# EAGLE design Power Supply V1p1 (EAGLE 9.6.2)
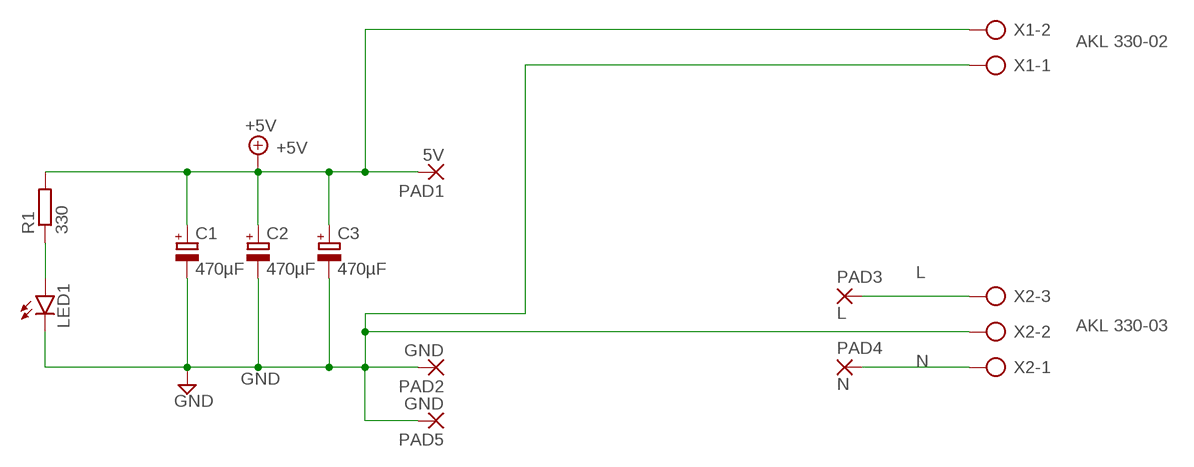
[diagram p0: schematic, sheet 1]

## Parts
C1  470µF  CPOL-EUE5-10.5  [E5-10,5]
C2  470µF  CPOL-EUE5-10.5  [E5-10,5]
C3  470µF  CPOL-EUE5-10.5  [E5-10,5]
LED1  LED5MM  [LED5MM]
PAD1  5V  SMD5  [SMD2,54-5,08]
PAD2  GND  SMD5  [SMD2,54-5,08]
PAD3  L  SMD5  [SMD2,54-5,08]
PAD4  N  SMD5  [SMD2,54-5,08]
PAD5  GND  SMD5  [SMD2,54-5,08]
R1  330  R-EU_R1206  [R1206]
X1  AK500/2-H  [AK500/2-H]
X2  AK500/3-H  [AK500/3-H]

## Nets
+5V: C1.+ C2.+ C3.+ PAD1.1(P) R1.2 X1.2
GND: C1.- C2.- C3.- LED1.K(C) PAD2.1(P) PAD5.1(P) X1.1 X2.2
L: PAD3.1(P) X2.3
N: PAD4.1(P) X2.1
N$1: LED1.A R1.1

## Notes on the sheet
- AKL 330-02
- AKL 330-03

## Library data of the parts
C1-C3 = rcl:CPOL-EU: POLARIZED CAPACITOR, European symbol; SPICEPREFIX: C
LED1 = led:LED: LED OSRAM: - CHIPLED LG R971, LG N971, LY N971, LG Q971, LY Q971, LO R971, LY R971 LH N974, LH R974 LS Q976, LO Q976, LY Q976 LO Q996 - Hyper CHIPLED LW Q18S LB Q993, LB Q99A, LB R99A - SideLED LS A670, LO A670, LY A670, LG A670, LP A670 LB A673, LV A673, LT A673, LW A673 LH A674 LY A675 LS A676, LA A676, LO A676, LY A676, LW A676 LS A679, LY A679, LG A679 - Hyper Micro SIDELED® LS Y876, LA Y876, LO Y876, LY Y876 LT Y87S - SmartLED LW L88C, LW L88S LB L89C, LB L89S, LG L890 LS L89K, LO L89K, LY L89K LS L896, LA L896, LO L896, LY L896 - TOPLED LS T670, LO T670, LY T670, LG T670, LP T670 LSG T670, LSP T670, LSY T670, LOP T670, LYG T670 LG T671, LOG T671, LSG T671 LB T673, LV T673, LT T673, LW T673 LH T674 LS T676, LA T676, LO T676, LY T676, LB T676, LH T676, LSB T676, LW T676 LB T67C, LV T67C, LT T67C, LS T67K, LO T67K, LY T67K, LW E67C LS E67B, LA E67B, LO E67B, LY E67B, LB E67C, LV E67C, LT E67C LW T67C LS T679, LY T679, LG T679 LS T770, LO T770, LY T770, LG T770, LP T770 LB T773, LV T773, LT T773, LW T773 LH T774 LS E675, LA E675, LY E675, LS T675 LS T776, LA T776, LO T776, LY T776, LB T776 LHGB T686 LT T68C, LB T68C - Hyper Mini TOPLED® LB M676 - Mini TOPLED Santana® LG M470 LS M47K, LO M47K, LY M47K Source: http://www.osram.convergy.de LUXEON: - LUMILED® LXK2-PW12-R00, LXK2-PW12-S00, LXK2-PW14-U00, LXK2-PW14-V00 LXK2-PM12-R00, LXK2-PM12-S00, LXK2-PM14-U00 LXK2-PE12-Q00, LXK2-PE12-R00, LXK2-PE12-S00, LXK2-PE14-T00, LXK2-PE14-U00 LXK2-PB12-K00, LXK2-PB12-L00, LXK2-PB12-M00, LXK2-PB14-N00, LXK2-PB14-P00, LXK2-PB14-Q00 LXK2-PR12-L00, LXK2-PR12-M00, LXK2-PR14-Q00, LXK2-PR14-R00 LXK2-PD12-Q00, LXK2-PD12-R00, LXK2-PD12-S00 LXK2-PH12-R00, LXK2-PH12-S00 LXK2-PL12-P00, LXK2-PL12-Q00, LXK2-PL12-R00 Source: www.luxeon.com KINGBRIGHT: KA-3528ASYC Source: www.kingbright.com
PAD1-PAD5 = wirepad:SMD5: SMD PAD
R1 = rcl:R-EU_: RESISTOR, European symbol; SPICEPREFIX: R
X1 = con-ptr500:AK500/2-H: CONNECTOR Aug. 2004 / PTR Meßtechnik: Die Bezeichnung der Serie AK505 wurde geändert. Es handelt sich hierbei um AK500 in horizontaler Ausführung.; OC_FARNELL: unknown; OC_NEWARK: unknown
X2 = con-ptr500:AK500/3-H: CONNECTOR Aug. 2004 / PTR Meßtechnik: Die Bezeichnung der Serie AK505 wurde geändert. Es handelt sich hierbei um AK500 in horizontaler Ausführung.; OC_FARNELL: unknown; OC_NEWARK: unknown

## Board
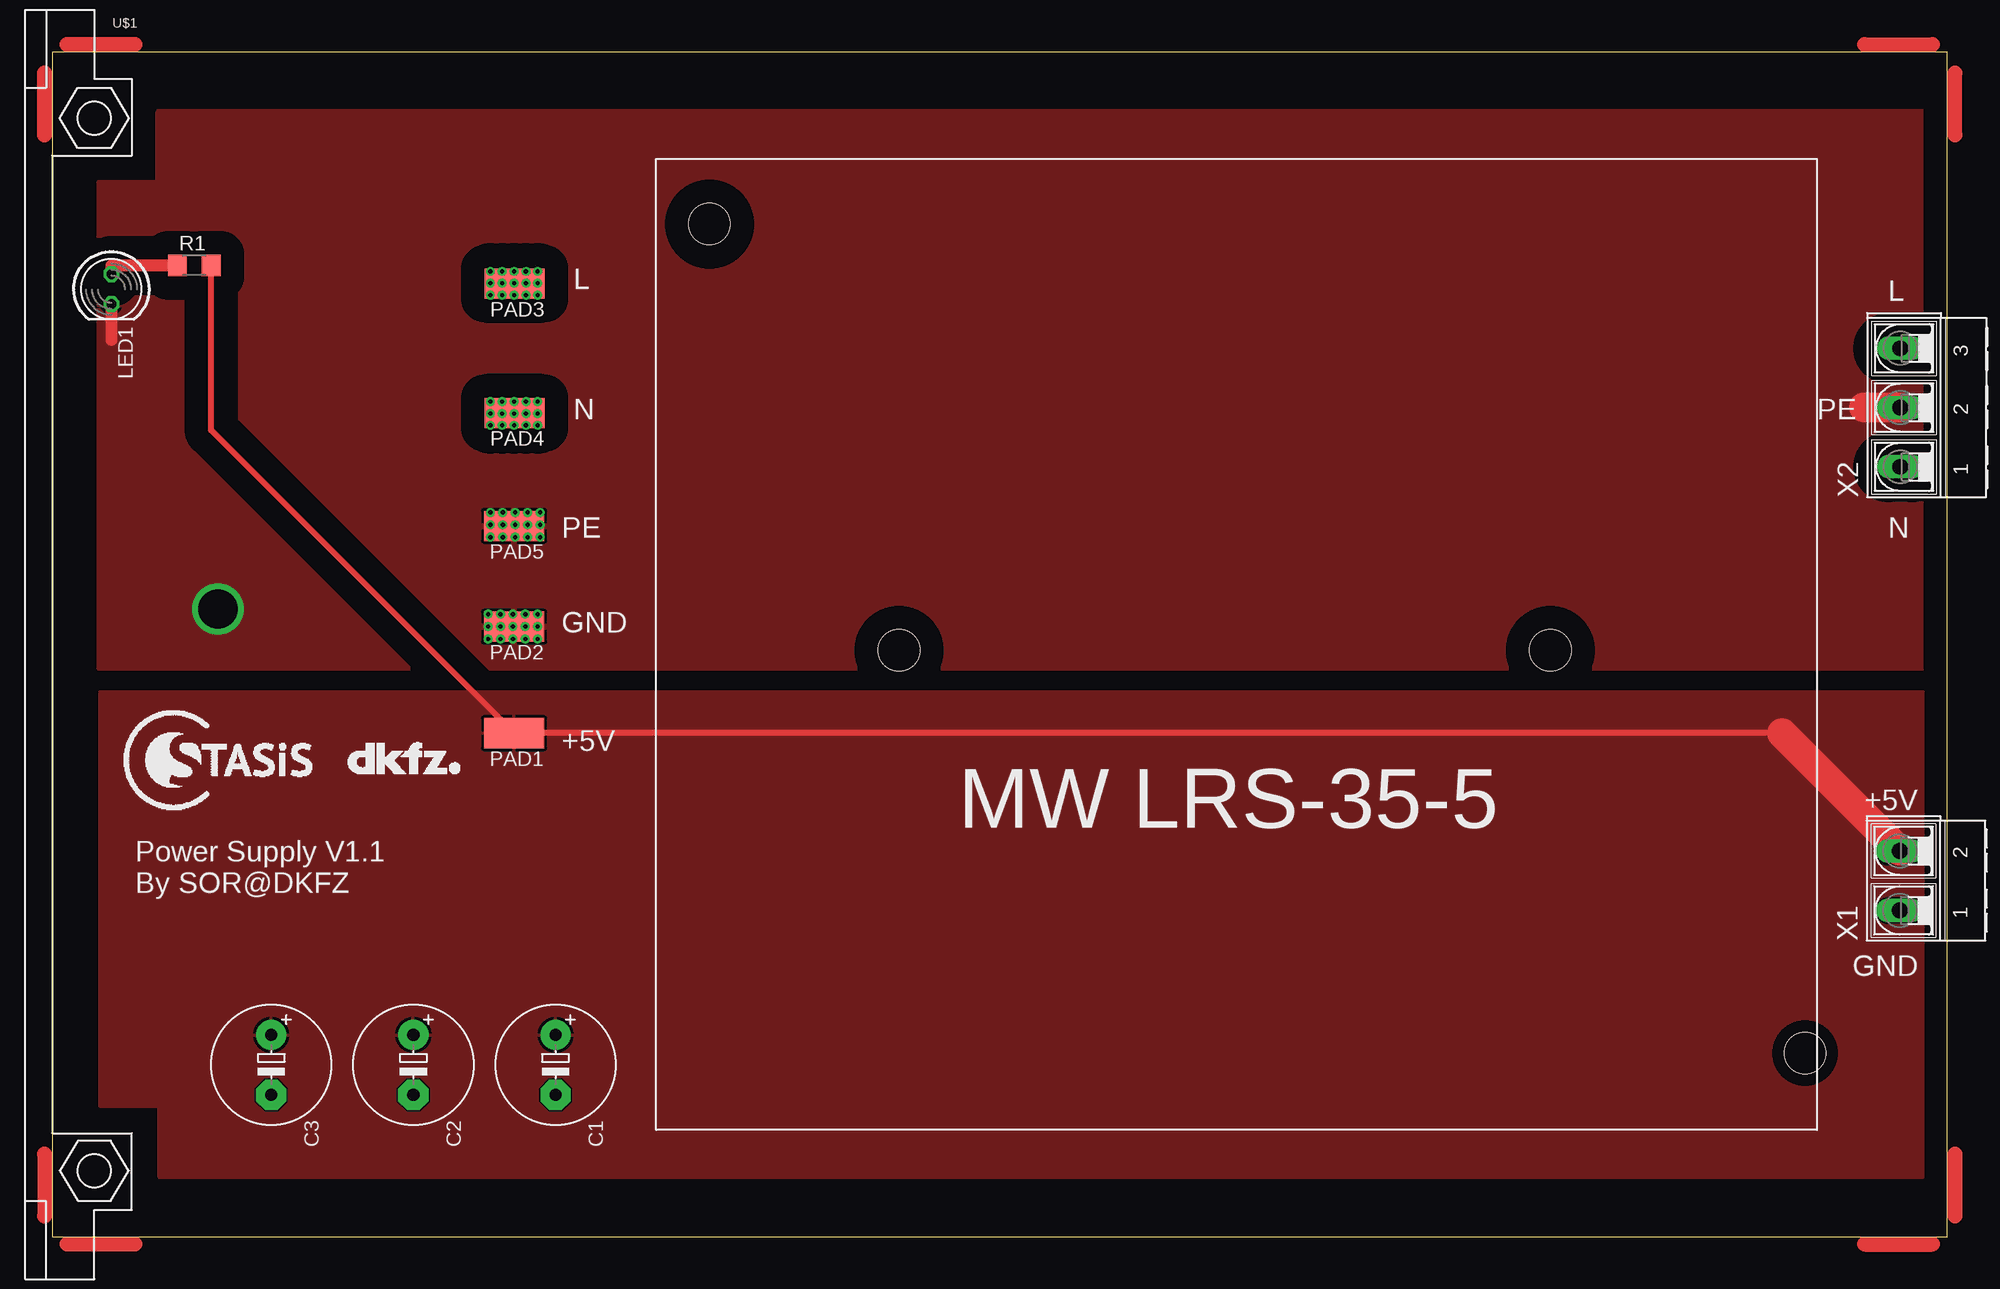
[diagram p1: board, top side]
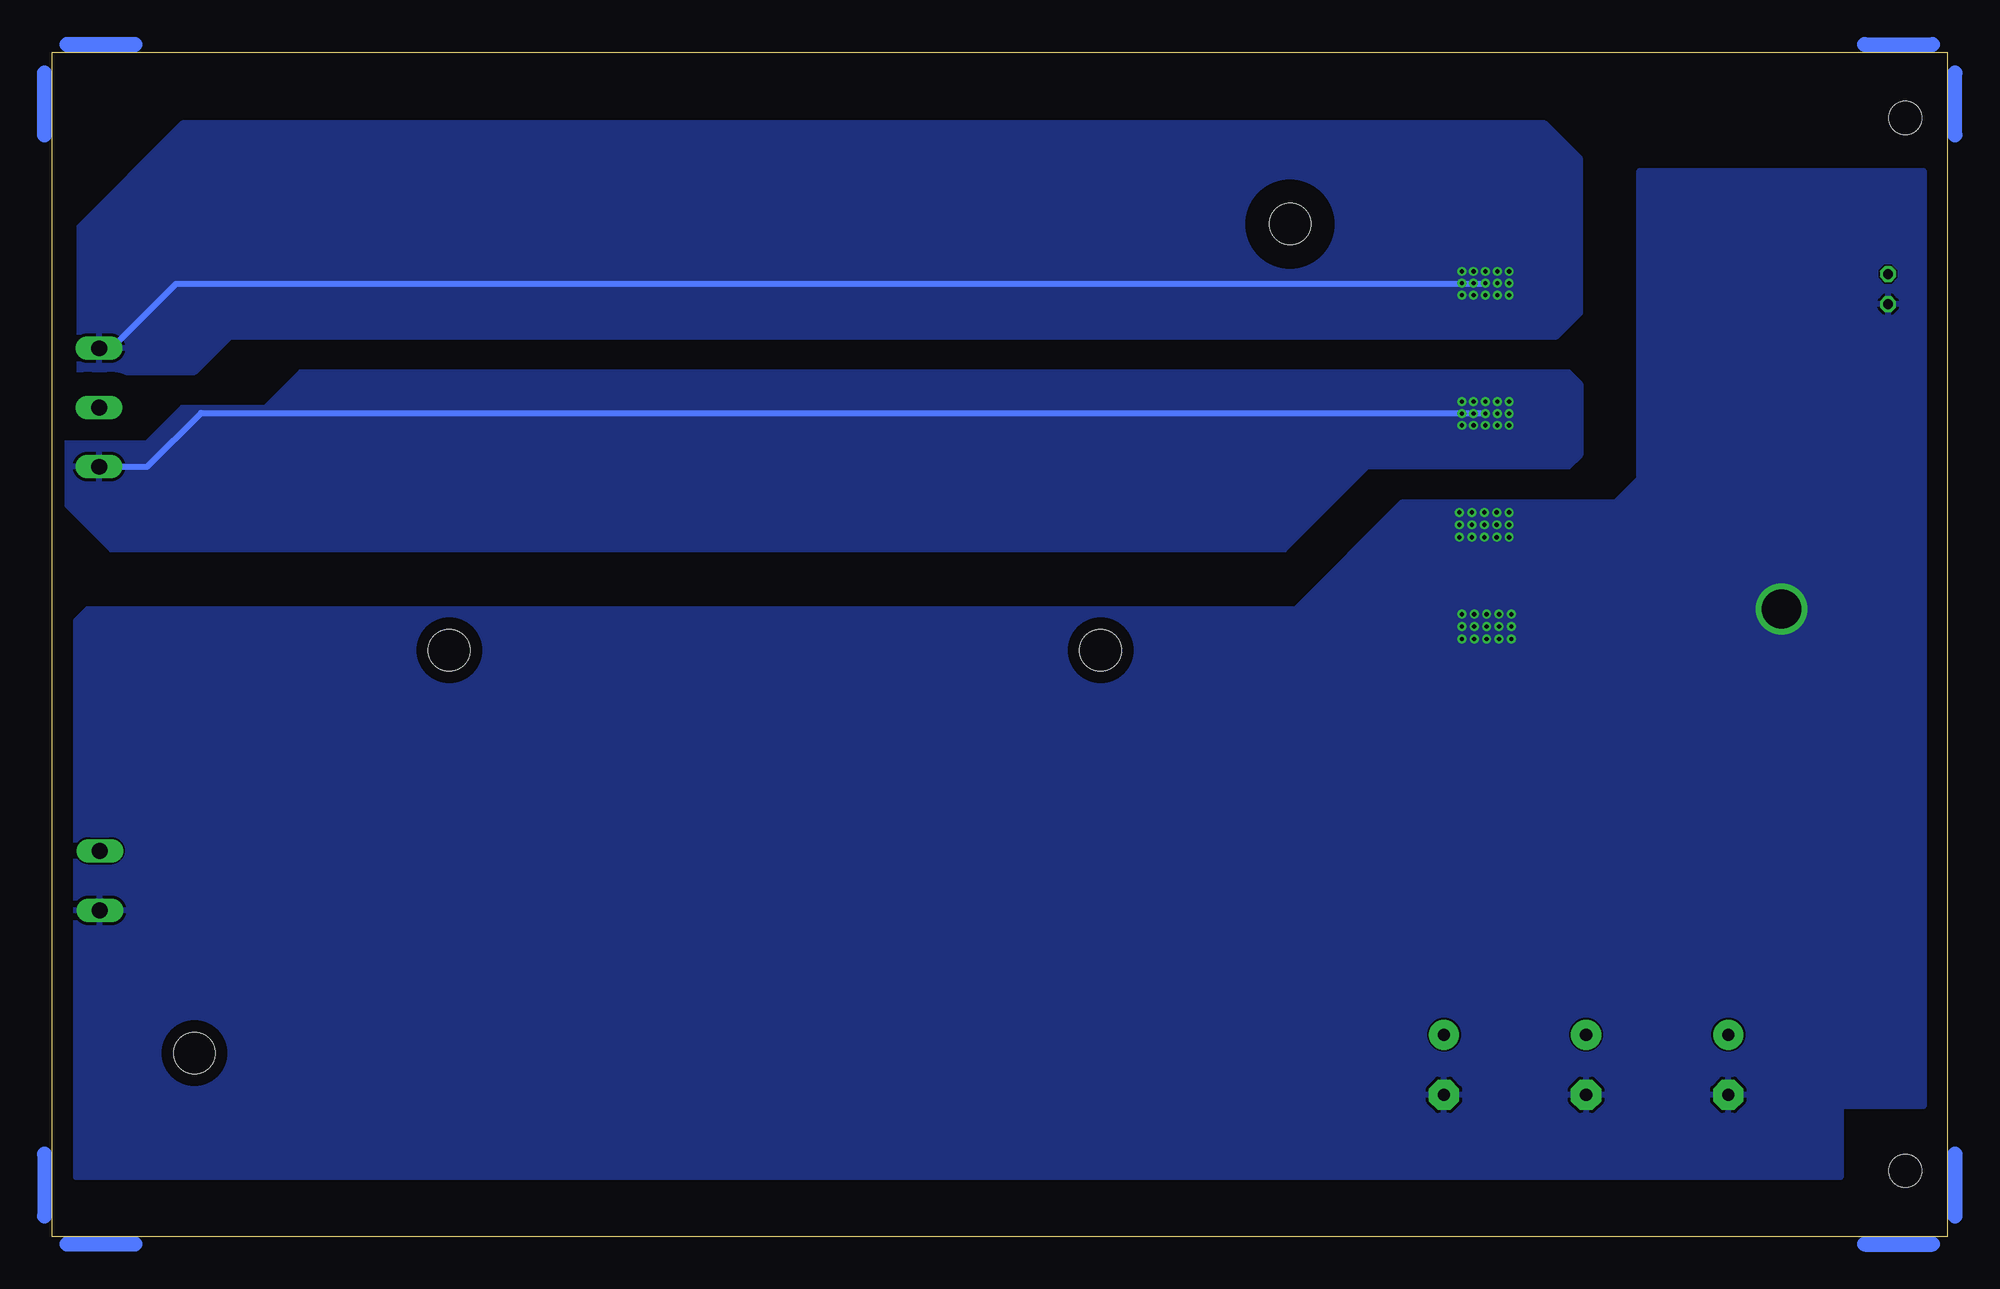
[diagram p2: board, bottom side, seen from below]

Size 160.02 x 100.03 mm. Coordinates in mm from the lower left corner, seen from the top.
Copper layers (1*16): Top 0.035mm / dielectric 1.5mm / Bottom 0.035mm
Design rules "default *": minimum track width 6mil, minimum drill 0.35mm, track to track 6mil, track to pad 6mil, pad to pad 6mil, via to via 6mil, smd to smd 6mil, copper to edge 40mil, drill to drill 6mil, minimum pad ring 10mil, minimum via ring 8mil, stop-mask expansion 4mil, vias tented up to drill 0mil, thermal gap 10mil
Holes 3.5 mm at 55.5,85.51 148,15.51 71.5,49.51 126.5,49.51

### Footprints (pad centres in the part's own frame; a part is rotated, then mirrored left to right if it is on the bottom)
E5-10,5 = drill 1.016 pad 2.54: + -2.54,0 | drill 1.016 pad 2.54 octagon: - 2.54,0
LED5MM = drill 0.813 octagon: A -1.27,0; K 1.27,0
SMD2,54-5,08 = smd 2.54 x 5.08: 1 0,0
R1206 = smd 1.6 x 1.803: 1 -1.422,0; 2 1.422,0
EK-FP = hole 2.794: 3.556,44.45; 3.556,-44.45
AK500/2-H = drill 1.321 long: 1 -2.515,0; 2 2.515,0
AK500/3-H = drill 1.321 long: 1 -5.004,0; 2 0,0; 3 5.004,0

### Placement (x,y rotation side)
C1  42.5,14.51 270 top
C2  30.5,14.51 270 top
C3  18.5,14.51 270 top
LED1  5,80.01 270 top
PAD1  39,42.51 90 top
PAD2  39,51.51 90 top
PAD3  39.05,80.46 90 top
PAD4  39.05,69.56 90 top
PAD5  39,60.01 90 top
R1  12,82.01 0 top
U$1  [EK-FP]  0,50.01 0 top
U$2  [LOGO_STASIS]  15,40.01 0 top
U$3  [LOGO_DKFZ]  25,39.01 0 top
X1  156,30.06 90 top
X2  156.05,70.01 90 top

### Tracks (layer width: path | path; a pad name or v marks a point on that pad's centre or on a via)
+5V
  Top 0.508: 146.06,42.51 PAD1.1 13.42,68.09 R1.2
  Top 2.54: X1.2 146.06,42.51
  pour Top: 4,46.01 4,11.01 8,11.01 9,11.01 9,5.01 158,5.01 158,46.01
GND  (via drill 0.35, 3.3)
  Top 1.016: LED1.K 5,75.74
  Top 2.54: X2.2 153,70.01
  other vias: 37,61.16 38.05,61.16 39.1,61.16 40.15,61.16 41.2,61.16 41.2,60.11 40.15,60.11 39.1,60.11 38.05,60.11 37,60.11 41.2,59.06 40.15,59.06 39.1,59.06 38.05,59.06 37,59.06 36.8,52.56 37.85,52.56 38.9,52.56 39.95,52.56 41,52.56 41,51.51 39.95,51.51 38.9,51.51 37.85,51.51 36.8,51.51 41,50.46 39.95,50.46 38.9,50.46 37.85,50.46 36.8,50.46 14,53.01
  pour Top (isolate 2): 4,48.01 4,89.01 9,89.01 9,95.01 158,95.01 158,48.01
  pour Bottom: 2,90.01 2,11.01 9,11.01 9,5.01 158,5.01 158,52.01 157,53.01 55,53.01 46,62.01 28,62.01 26,64.01 26,90.01
L  (via drill 0.35)
  Top 2.54: PAD3.1 39.1,80.51 v40,80.51
  Bottom 0.508: X2.3 155,75.02 149.55,80.46 PAD3.1
  other vias: 39,80.51 41,80.51 38,80.51 37,80.51 37,81.51 38,81.51 39,81.51 40,81.51 41,81.51 41,79.51 40,79.51 39,79.51 38,79.51 37,79.51
  pour Bottom (isolate 2): 158,73.01 148,73.01 145,76.01 33,76.01 31,78.01 31,91.01 34,94.01 149,94.01 158,85.01
N  (via drill 0.35)
  Top 2.54: PAD4.1 39.95,69.56 v40,69.51
  Bottom 0.508: X2.1 152,65.01 147.45,69.56 PAD4.1
  other vias: 39,70.51 39,69.51 39,68.51 38,68.51 37,68.51 37,69.51 37,70.51 38,70.51 38,69.51 40,70.51 41,70.51 41,69.51 40,68.51 41,68.51
  pour Bottom: 32,73.01 31,72.01 31,66.01 32,65.01 49,65.01 56,58.01 155,58.01 159,62.01 159,67.01 152,67.01 149,70.01 142,70.01 139,73.01
N$1
  Top 1.016: R1.1 5,82.01 LED1.A

### Text on the board
tPlace: L | L | N | PE | PE | N | GND | +5V | +5V | MW LRS-35-5 | Power Supply V1.1 / By SOR@DKFZ | GND